# Altium schematic sheet MDC_ESP32.SchDoc
size A4
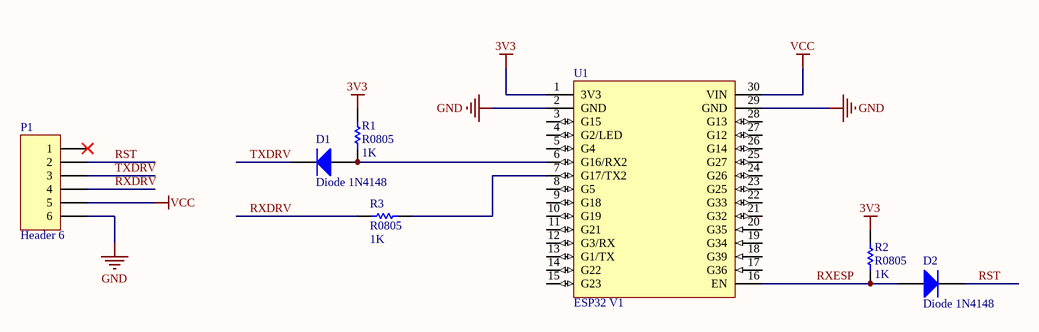
[diagram p0: MDC_ESP32.SchDoc]

## Parts
D1  Diode 1N4148  [1N4148SMD]
D2  Diode 1N4148  [1N4148SMD]
P1  Header 6  [HDR1X6]
R1  R0805  value 1K  [R0805]
R2  R0805  value 1K  [R0805]
R3  R0805  value 1K  [R0805]
U1  ESP32 V1  [ESP32_V1]

## Nets
3V3: R1.2 R2.2 U1.1(3V3)
GND: P1.6 U1.2(GND) U1.29(GND)
VCC: P1.5 U1.30(VIN)
RST: D2.2(K) P1.2
RXDRV: P1.4 R3.1
RXESP: D2.1(A) R2.1 U1.16(EN)
TXDRV: D1.2(K) P1.3
NetD1_1: D1.1(A) R1.1 U1.6(G16/RX2)
NetR3_2: R3.2 U1.7(G17/TX2)

Not connected (* = marked no-connect by the designer): P1 1*; U1 3(G15) 4(G2/LED) 5(G4) 8(G5) 9(G18) 10(G19) 11(G21) 12(G3/RX) 13(G1/TX) 14(G22) 15(G23) 17(G36) 18(G39) 19(G34) 20(G35) 21(G32) 22(G33) 23(G25) 24(G26) 25(G27) 26(G14) 27(G12) 28(G13)

## Library data of the parts
D1 D2 = Diode 1N4148: 1N4148; Part: 1N4148WTPMSCT; Proveedor: Digikey; Published: 8-Jun-2000; LatestRevisionDate: 17-Jul-2002; LatestRevisionNote: Re-released for DXP Platform.; PackageVersion: Sep-1996; PackageReference: SMC; Publisher: Altium Limited; Code_JEDEC: DO-214-AB; Price: 0.14
P1 = Header 6: Header, 6-Pin; LatestRevisionDate: 17-Jul-2002; LatestRevisionNote: Re-released for DXP Platform.; Publisher: Altium Limited
R1-R3 = Res 0805 1K: Semiconductor Resistor; Part: 311-1.0KARCT-ND; Proveedor: Digikey; Published: 8-Jun-2000; LatestRevisionDate: 17-Jul-2002; LatestRevisionNote: Re-released for DXP Platform.; PackageReference: AXIAL-0.5; Publisher: Altium Limited; Price: 0.1
U1 = ESP32_V1: ESP32 V1 Module